# EAGLE design tiny_rack_v2_psu_exp_170 (EAGLE 9.6.2)

## Sheet 1 of 2
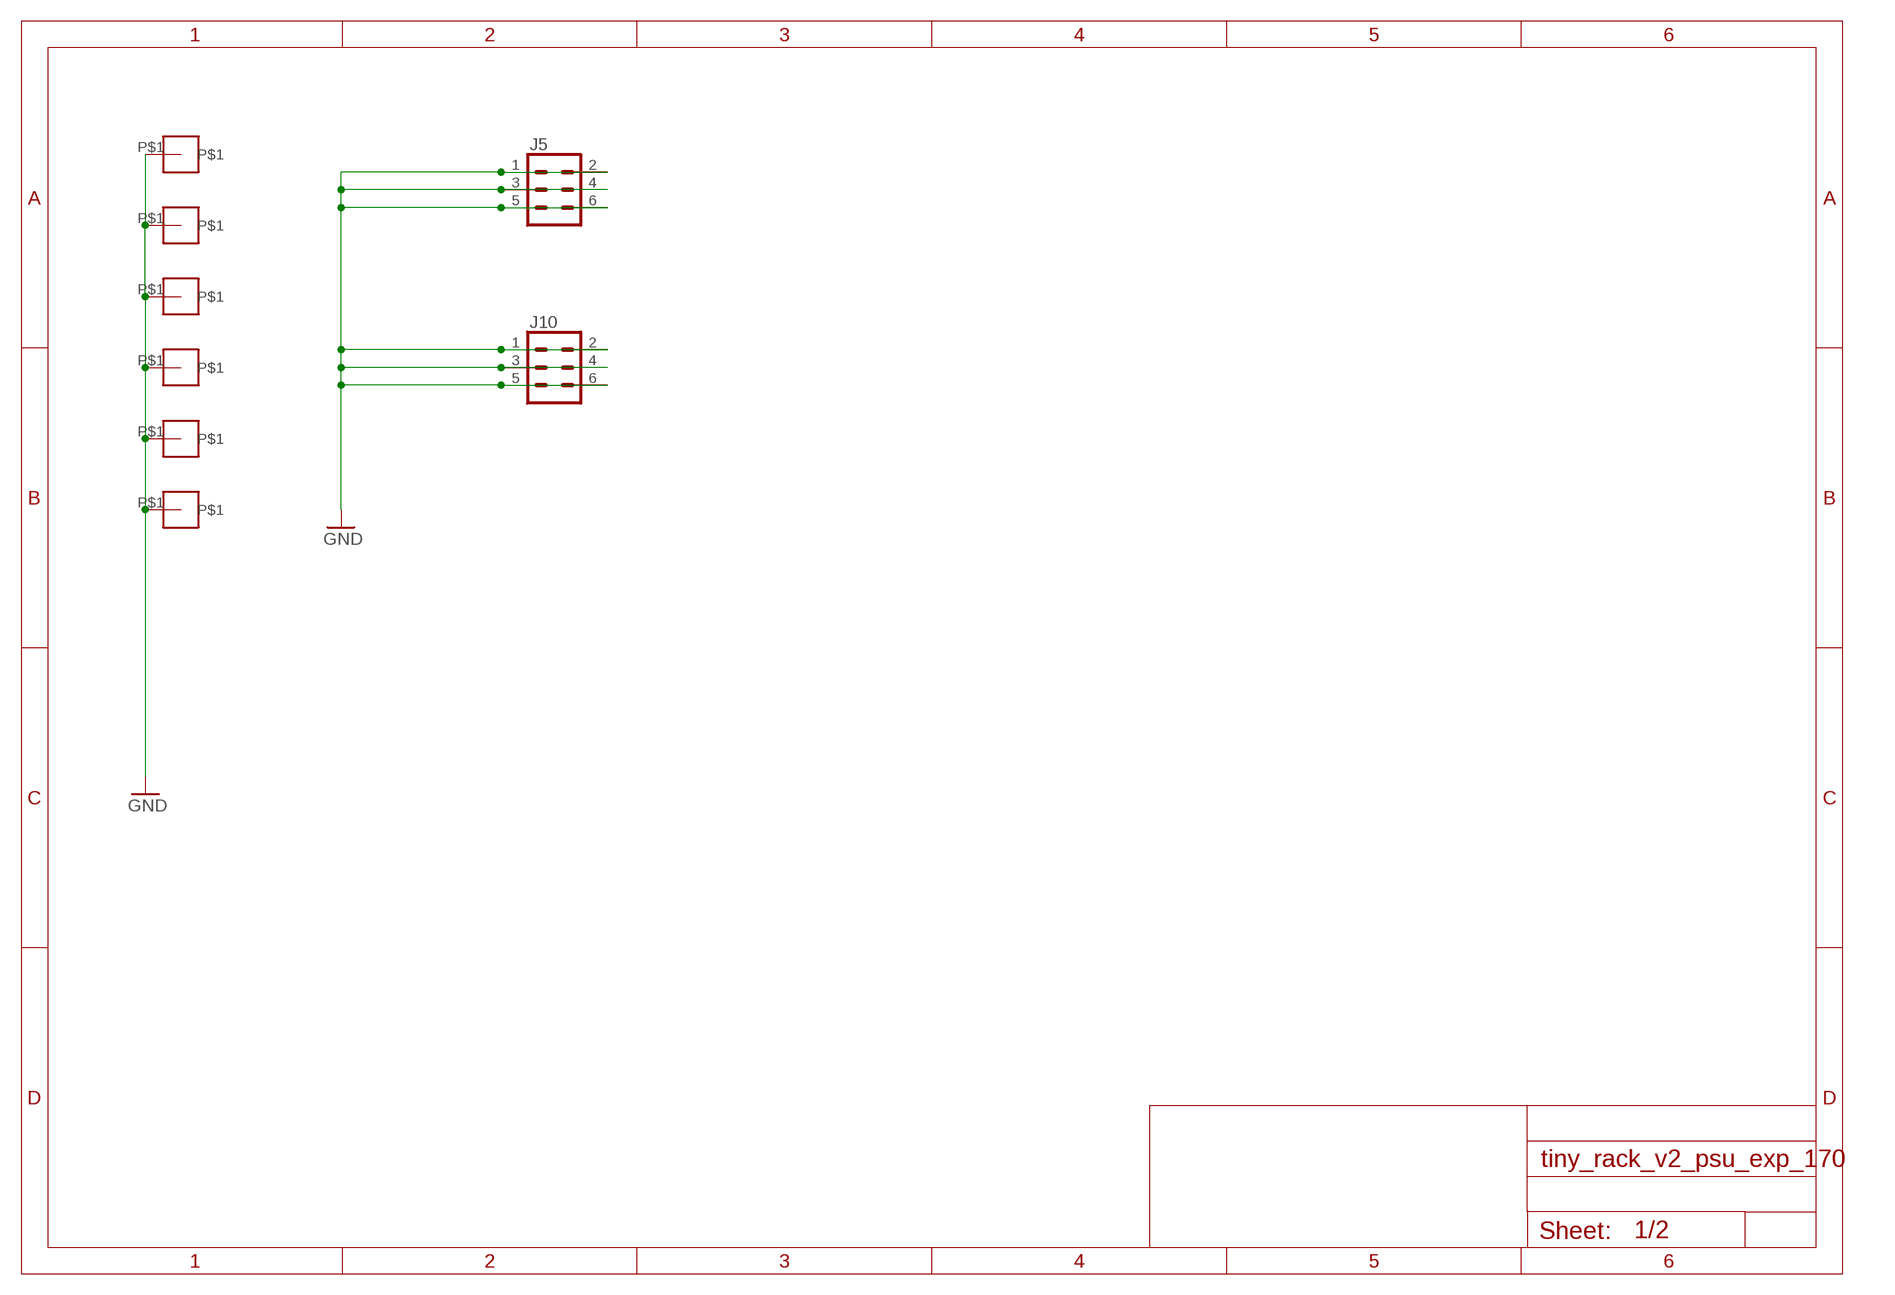
[diagram p0: schematic, sheet 1]

### Parts
J5  CONN_03X2FEMALE_SMD  [2X3_SMD]
J10  CONN_03X2FEMALE_SMD  [2X3_SMD]
U$1  M3-HOLE  [M3-HOLE]
U$2  M3-HOLE  [M3-HOLE]
U$3  M3-HOLE  [M3-HOLE]
U$4  M3-HOLE  [M3-HOLE]
U$5  M3-HOLE  [M3-HOLE]
U$6  M3-HOLE  [M3-HOLE]

### Nets
GND: J5.1 J5.2 J5.3 J5.4 J5.5 J5.6 J10.1 J10.2 J10.3 J10.4 J10.5 J10.6 U$1.P$1 U$2.P$1 U$3.P$1 U$4.P$1 U$5.P$1 U$6.P$1 ; also sheet 2

## Sheet 2 of 2
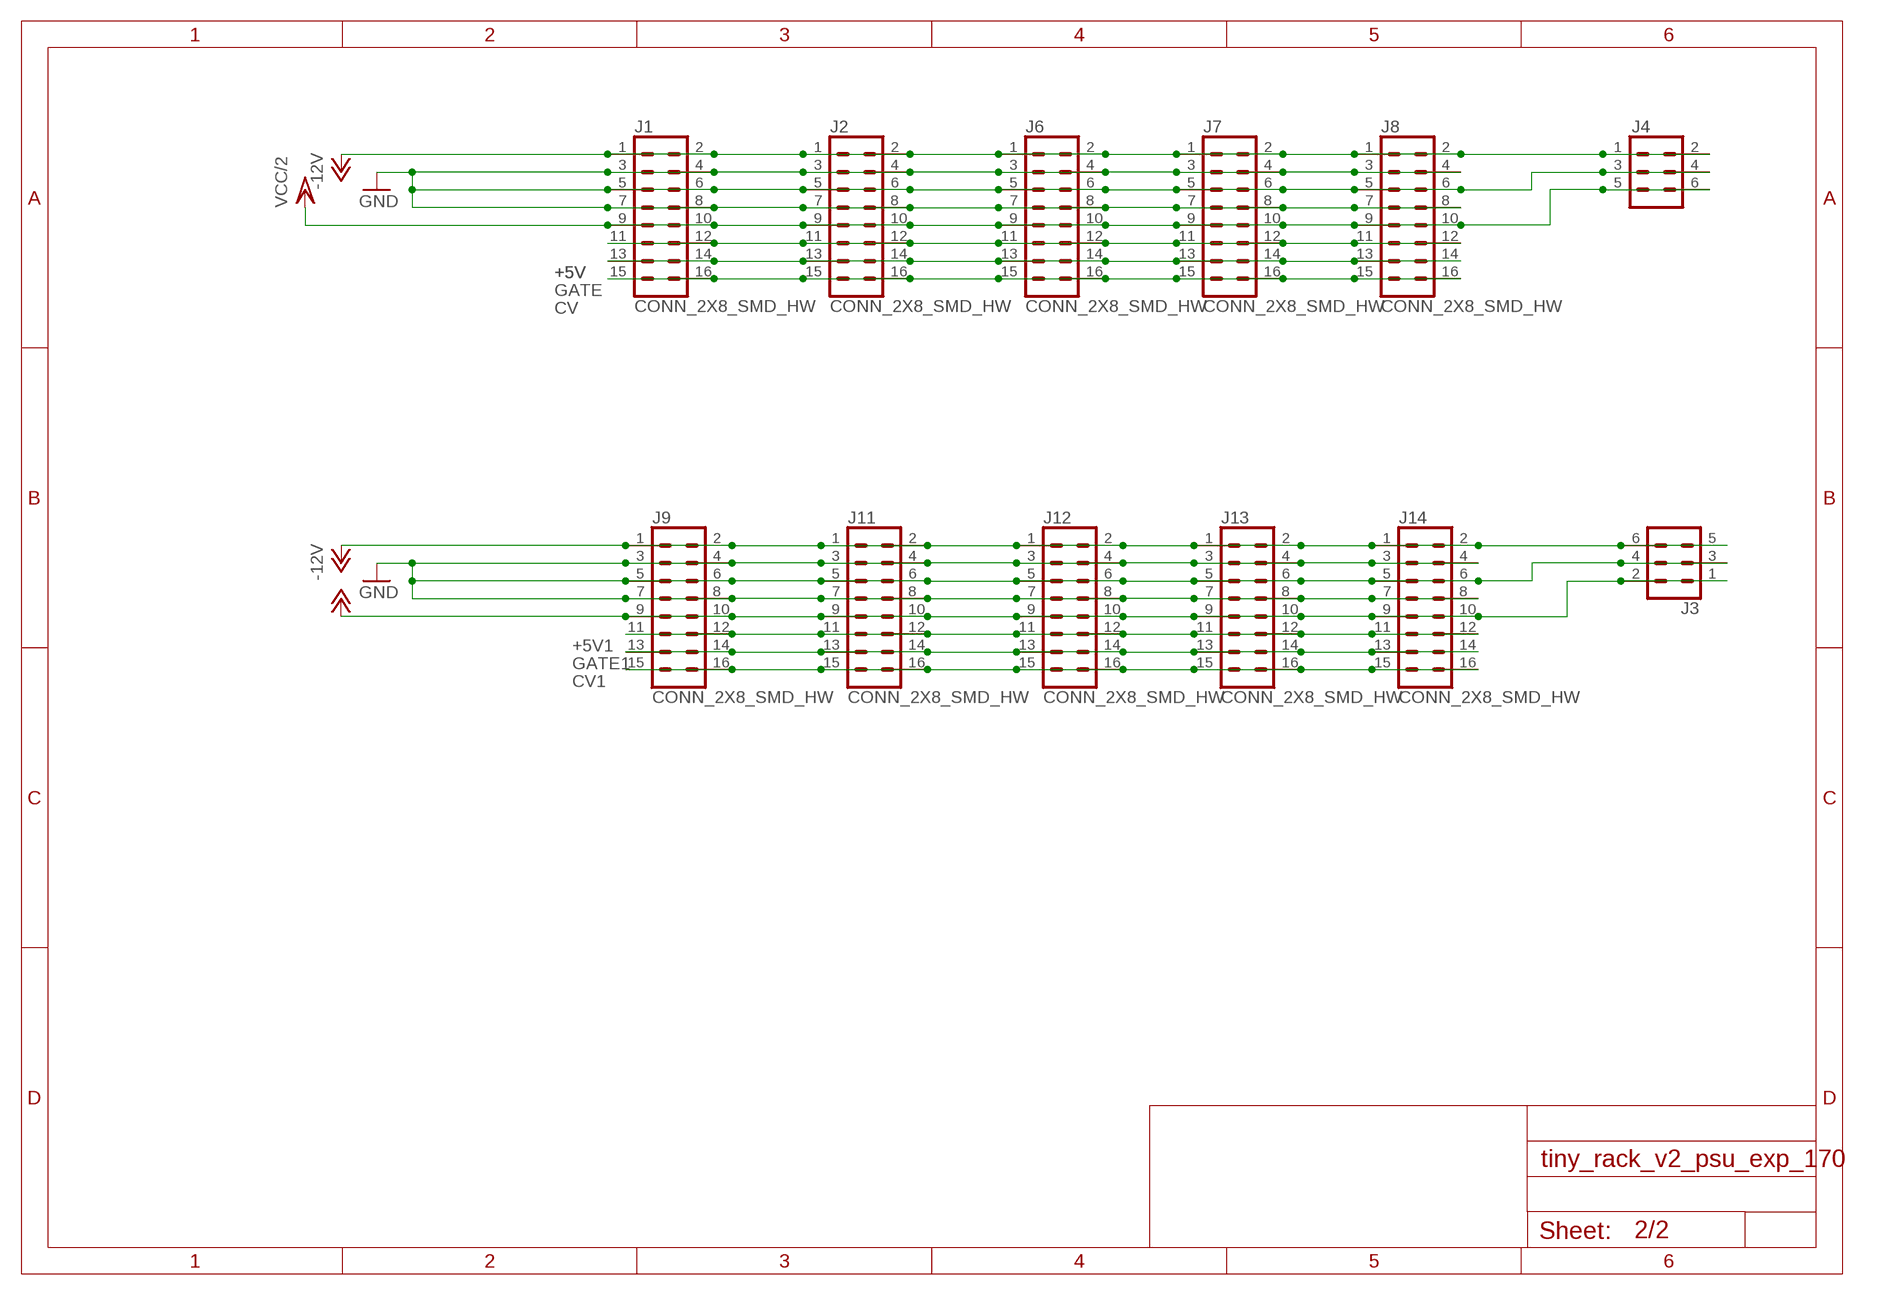
[diagram p1: schematic, sheet 2]

### Parts
J1  CONN_2X8_SMD_HW  [2X8-SHROUDED_SMD_HW]
J2  CONN_2X8_SMD_HW  [2X8-SHROUDED_SMD_HW]
J3  CONN_03X2FEMALE_SMD  [2X3_SMD]
J4  CONN_03X2FEMALE_SMD  [2X3_SMD]
J6  CONN_2X8_SMD_HW  [2X8-SHROUDED_SMD_HW]
J7  CONN_2X8_SMD_HW  [2X8-SHROUDED_SMD_HW]
J8  CONN_2X8_SMD_HW  [2X8-SHROUDED_SMD_HW]
J9  CONN_2X8_SMD_HW  [2X8-SHROUDED_SMD_HW]
J11  CONN_2X8_SMD_HW  [2X8-SHROUDED_SMD_HW]
J12  CONN_2X8_SMD_HW  [2X8-SHROUDED_SMD_HW]
J13  CONN_2X8_SMD_HW  [2X8-SHROUDED_SMD_HW]
J14  CONN_2X8_SMD_HW  [2X8-SHROUDED_SMD_HW]

### Nets
+5V: J1.11 J1.12 J2.11 J2.12 J6.11 J6.12 J7.11 J7.12 J8.11 J8.12
+5V1: J9.11 J9.12 J11.11 J11.12 J12.11 J12.12 J13.11 J13.12 J14.11 J14.12
+12V: J3.1 J3.2 J9.9 J9.10 J11.9 J11.10 J12.9 J12.10 J13.9 J13.10 J14.9 J14.10
-12V: J1.1 J1.2 J2.1 J2.2 J3.5 J3.6 J4.1 J4.2 J6.1 J6.2 J7.1 J7.2 J8.1 J8.2 J9.1 J9.2 J11.1 J11.2 J12.1 J12.2 J13.1 J13.2 J14.1 J14.2
CV: J1.15 J1.16 J2.15 J2.16 J6.15 J6.16 J7.15 J7.16 J8.15 J8.16
CV1: J9.15 J9.16 J11.15 J11.16 J12.15 J12.16 J13.15 J13.16 J14.15 J14.16
GATE: J1.13 J1.14 J2.13 J2.14 J6.13 J6.14 J7.13 J7.14 J8.13 J8.14
GATE1: J9.13 J9.14 J11.13 J11.14 J12.13 J12.14 J13.13 J13.14 J14.13 J14.14
GND: J1.3 J1.4 J1.5 J1.6 J1.7 J1.8 J2.3 J2.4 J2.5 J2.6 J2.7 J2.8 J3.3 J3.4 J4.3 J4.4 J6.3 J6.4 J6.5 J6.6 J6.7 J6.8 J7.3 J7.4 J7.5 J7.6 J7.7 J7.8 J8.3 J8.4 J8.5 J8.6 J8.7 J8.8 J9.3 J9.4 J9.5 J9.6 J9.7 J9.8 J11.3 J11.4 J11.5 J11.6 J11.7 J11.8 J12.3 J12.4 J12.5 J12.6 J12.7 J12.8 J13.3 J13.4 J13.5 J13.6 J13.7 J13.8 J14.3 J14.4 J14.5 J14.6 J14.7 J14.8 ; also sheet 1
VCC/2: J1.9 J1.10 J2.9 J2.10 J4.5 J4.6 J6.9 J6.10 J7.9 J7.10 J8.9 J8.10

## Library data of the parts
J1 J2 J6-J9 J11-J14 = conn-fc:CONN_2X8_SMD_HW
J3-J5 J10 = SparkFun-Connectors:CONN_03X2: Multi connection point. Often used as Generic Header-pin footprint for 0.1 inch spaced/style header connections You can populate with any combo of single row headers, but if you'd like an exact match, check these: Header - 2x3 (Male, 0.1") <https://www.sparkfun.com/products/12807> (PRT-12807) Header - 2x3 (Female, 0.1") <https://www.sparkfun.com/products/13010> (PRT-13010) 2x3 Pin Shrouded Header <https://www.sparkfun.com/products/10877> (PRT-10877) On any of the 0.1 inch spaced packages, you can populate with these: Break Away Headers - Straight <https://www.sparkfun.com/products/116> (PRT-00116) Break Away Male Headers - Right Angle <https://www.sparkfun.com/products/553> (PRT-00553) Female Headers <https://www.sparkfun.com/products/115> (PRT-00115) Break Away Headers - Machine Pin <https://www.sparkfun.com/products/117> (PRT-00117) Break Away Female Headers - Swiss Machine Pin <https://www.sparkfun.com/products/743> (PRT-00743) Special note: the shrouded connector mates well with our 3x2 ribbon cables: Ribbon Crimp Connector - 6-pin (2x3, Female) <https://www.sparkfun.com/products/10651> (PRT-10651) Ribbon Cable - 6 wire (15ft) <https://www.sparkfun.com/products/10646> (PRT-10646); PROD_ID: CONN-11290
U$1-U$6 = biti:M3-HOLE

## Board
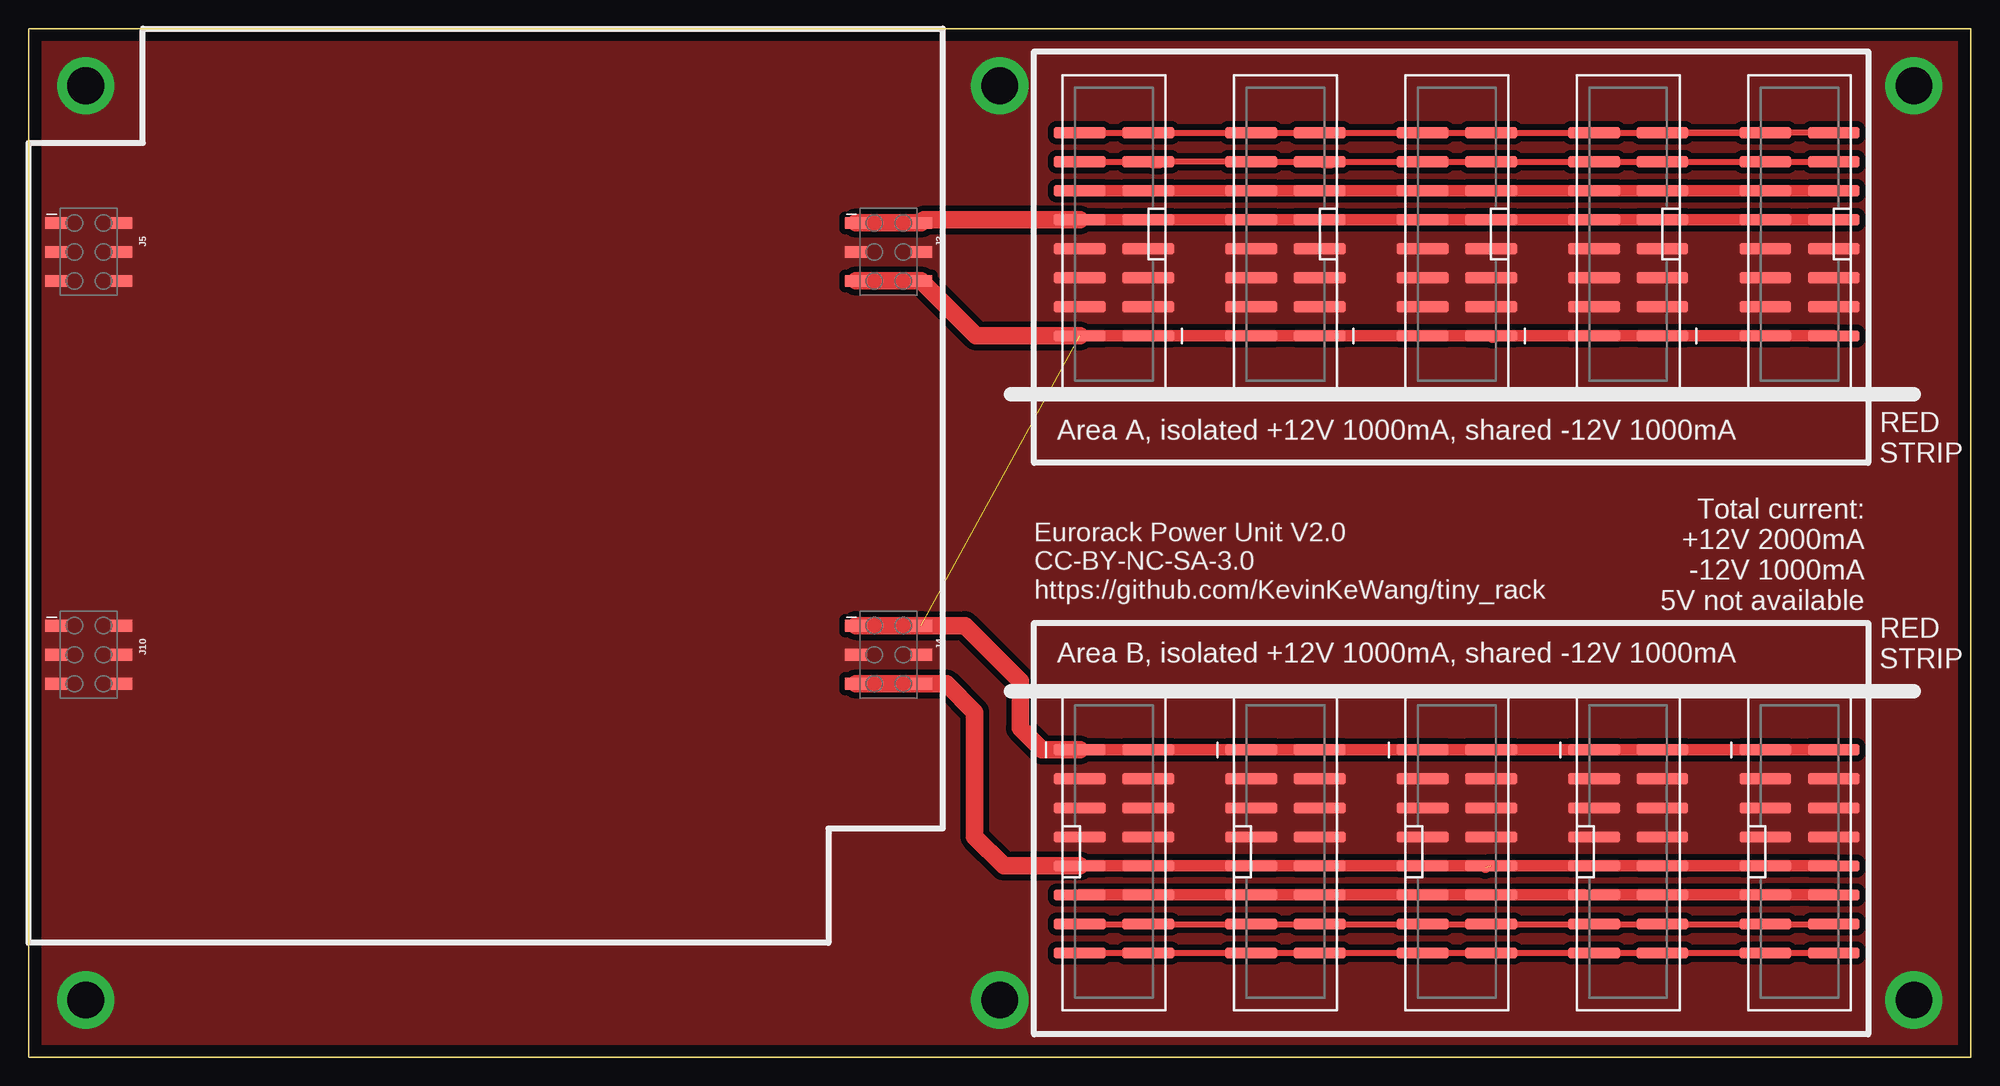
[diagram p2: board, top side]
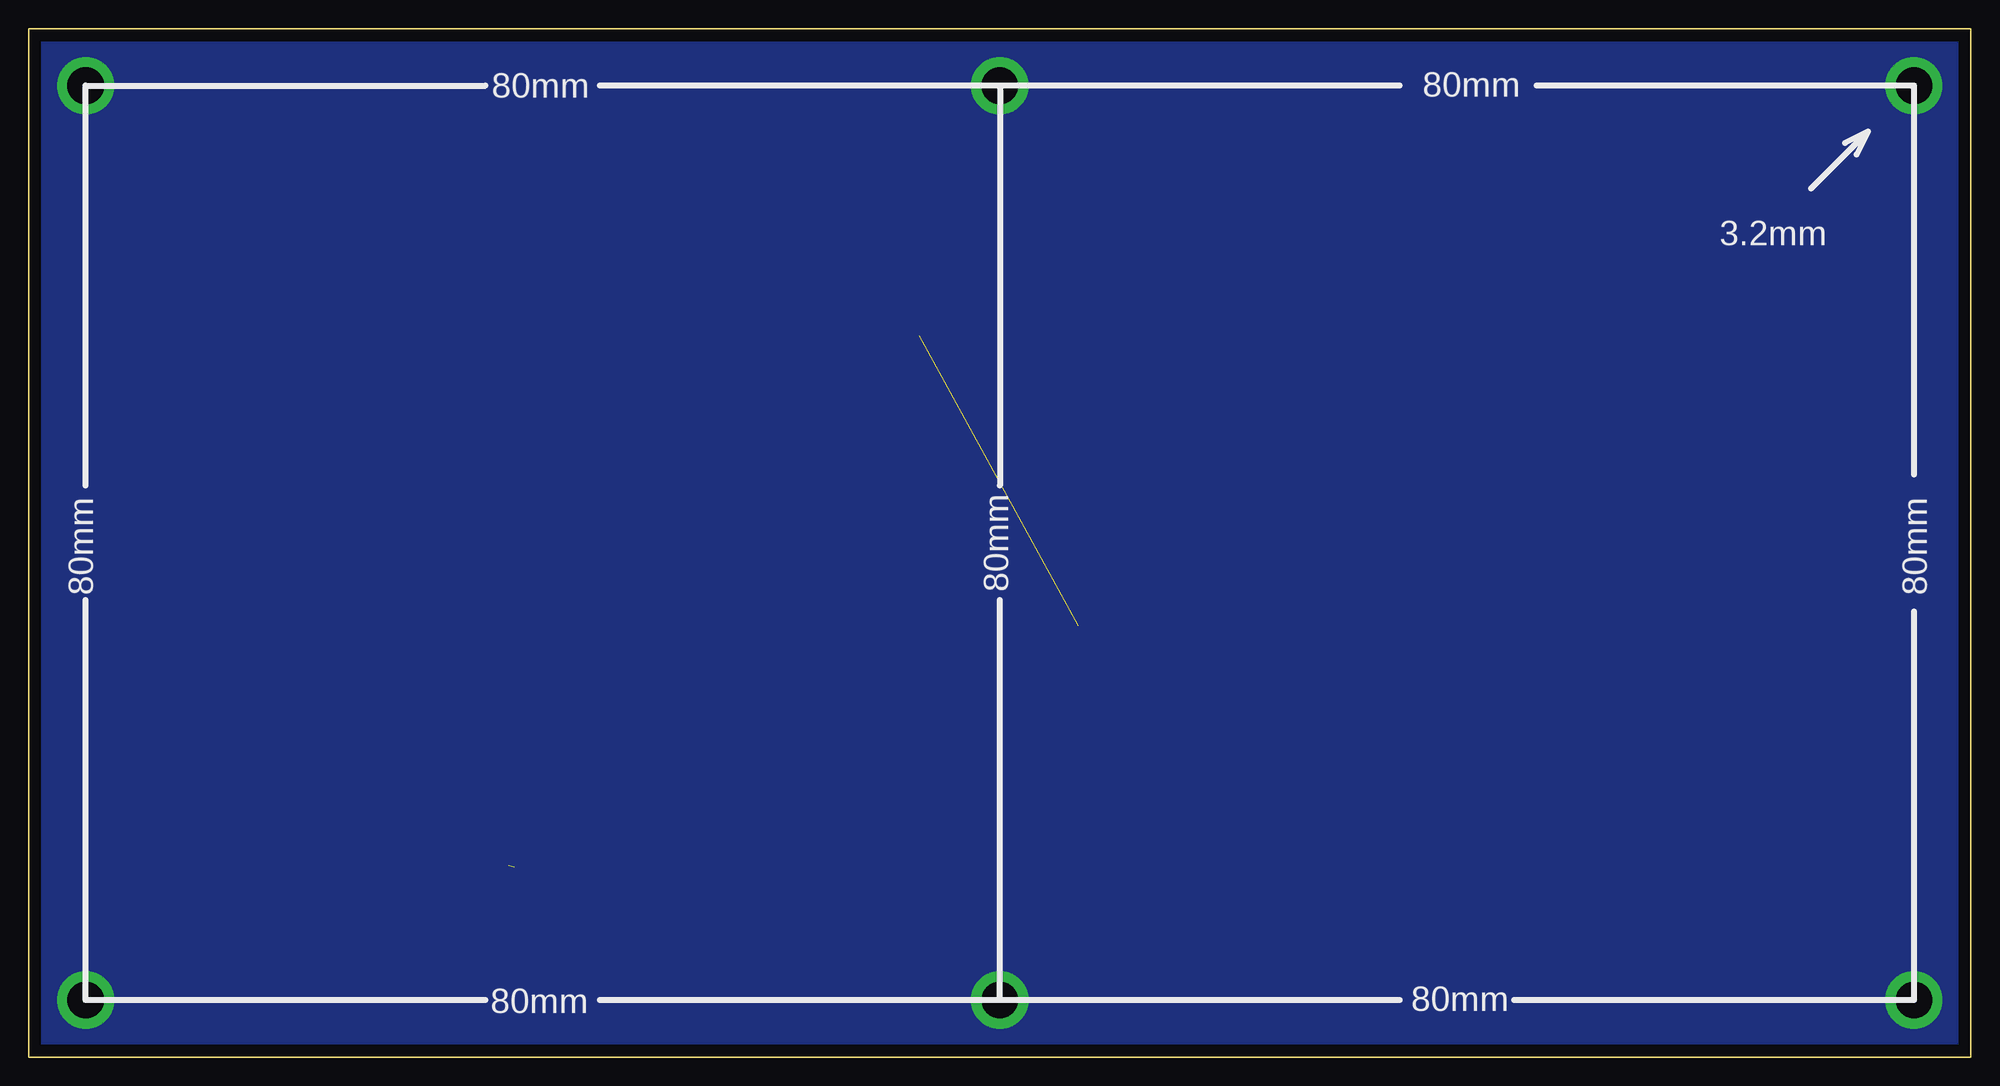
[diagram p3: board, bottom side, seen from below]

Size 170 x 90 mm. Coordinates in mm from the lower left corner, seen from the top.
Outline: 0,0 170,0 170,90 0,90 0,0
Copper layers (1+2*15+16): Top 0.035mm / dielectric 0.3mm / Route2 0.035mm / dielectric 0.75mm / Route15 0.035mm / dielectric 0.3mm / Bottom 0.035mm
Design rules "default *": minimum track width 20mil, minimum drill 0.35mm, track to track 20mil, track to pad 20mil, pad to pad 20mil, via to via 20mil, smd to smd 6mil, copper to edge 40mil, drill to drill 6mil, minimum pad ring 10mil, minimum via ring 8mil, stop-mask expansion 4mil, vias tented up to drill 0mil, thermal gap 10mil

### Footprints (pad centres in the part's own frame; a part is rotated, then mirrored left to right if it is on the bottom)
2X8-SHROUDED_SMD_HW = smd 4.55 x 1: 1 -2.994,8.89; 2 2.994,8.89; 3 -2.994,6.35; 4 2.994,6.35; 5 -2.994,3.81; 6 2.994,3.81; 7 -2.994,1.27; 8 2.994,1.27; 9 -2.994,-1.27; 10 2.994,-1.27; 11 -2.994,-3.81; 12 2.994,-3.81; 13 -2.994,-6.35; 14 2.994,-6.35; 15 -2.994,-8.89; 16 2.994,-8.89
2X3_SMD = smd 1.02 x 1.9: 1 -2.54,-2.85; 2 -2.54,2.85; 3 0,-2.85; 4 0,2.85; 5 2.54,-2.85; 6 2.54,2.85
M3-HOLE = drill 3.2 pad 5: P$1 0,0

### Placement (x,y rotation side)
J1  95,18 0 top
J2  110,18 0 top
J3  75.27,70.46 270 top
J4  75.27,35.21 270 top
J5  5.27,70.46 270 top
J6  125,18 0 top
J7  140,18 0 top
J8  155,18 0 top
J9  95,72 180 top
J10  5.27,35.21 270 top
J11  110,72 180 top
J12  125,72 180 top
J13  140,72 180 top
J14  155,72 180 top
U$1  5,5 0 top
U$2  5,85 0 top
U$3  85,5 0 top
U$4  85,85 0 top
U$5  165,5 0 top
U$6  165,85 0 top

### Tracks (layer width: path | path; a pad name or v marks a point on that pad's centre or on a via)
+5V
  Top 0.762: 136.1,14.19 J7.11
  Top 1.016: J1.11 J1.12 J2.11 J2.12 J6.11 J6.12 136.1,14.19 | J7.11 J7.12 J8.11 J8.12
+5V1
  Top 0.762: 157.4,75.81 J14.11 | 127.4,75.81 J12.11
  Top 1.016: J9.12 J9.11 J11.12 J11.11 J12.12 127.4,75.81 | J12.11 J13.12 J13.11 J14.12 157.4,75.81
+12V
  Top 1.016: J9.10 J9.9 J11.10 J11.9 J12.10 J12.9 J13.10 J13.9 J14.10 J14.9
  Top 1.524: J3.1 J3.2 78.39,73.27 J9.10
-12V  (1 unrouted)
  Top 0.762: 93,27 92.89,26.89 J1.1 | J9.1 98.89,63.11 99,63 | J8.2 158.89,26.89 159,27 158.1,27 J8.2 | J12.1 128.89,63.11 129,63 128.1,63 J12.1 | J14.1 158.89,63.11 159,63 158.1,63 J14.1
  Top 1.016: J14.1 J14.2 J13.1 J13.2 128.21,63.11 128.1,63 | J12.1 J12.2 J11.1 J11.2 J9.1 J9.2 | J1.1 J1.2 J2.1 J2.2 J6.1 J6.2 J7.1 J7.2 J8.1 J8.2
  Top 1.524: J3.5 J3.6 82.93,63.11 J9.2 | J4.1 J4.2 81.95,37.75 86.8,32.9 86.8,28.8 88.71,26.89 J1.1
CV
  Top 0.508: J8.16 J8.15 J7.16 J7.15 J6.16 J6.15 J2.16 J2.15 J1.16 J1.15
CV1
  Top 0.508: J9.16 J9.15 | J9.15 98.89,80.89 99,81 | 143.89,80.89 J13.16 J12.15 J12.16 J11.15 J11.16 J9.15 | 143.89,80.89 144,81 | J14.16 143.89,80.89 | J14.15 J14.16 | J13.15 J14.16
GATE
  Top 0.508: J1.13 J1.14 J2.13 J2.14 J6.13 J6.14 J7.13 J7.14 J8.13 J8.14
GATE1
  Top 0.508: J9.14 J9.13 | J9.13 98.65,78.35 99,78 98.34,78 J9.13 | J9.13 J11.14 J11.13 | J11.13 113.65,78.35 114,78 113.34,78 J11.13 | J11.13 J12.14 J12.13 J13.14 J13.13 J14.14 J14.13
GND
  pour Bottom (no thermals): 0,90 170,90 170,0 0,0
  pour Top (no thermals): 0,90 170,90 170,0 0,0
VCC/2  (1 unrouted)
  Top 0.813: 90.17,16.73 91.5,16.73
  Top 1.016: J8.10 J8.9 J7.10 J7.9 127.63,16.73 | 127.63,16.73 127.5,16.6 | 127.63,16.73 J6.9 J2.10 J2.9 J1.10 91.5,16.73
  Top 1.524: J1.9 91.5,16.73 85.37,16.73 82.8,19.3 82.8,30.2 80.33,32.67 J4.6 J4.5

### Text on the board
tNames: Area A, isolated +12V 1000mA, shared -12V 1000mA | RED / STRIP | Eurorack Power Unit V2.0 / CC-BY-NC-SA-3.0 / https://github.com/KevinKeWang/tiny_rack | Total current: / +12V 2000mA / -12V 1000mA / 5V not available | Area B, isolated +12V 1000mA, shared -12V 1000mA | RED / STRIP
bNames: 80mm | 80mm | 3.2mm | 80mm | 80mm | 80mm | 80mm | 80mm